# EAGLE schematic Prototype1 (EAGLE 6.1)
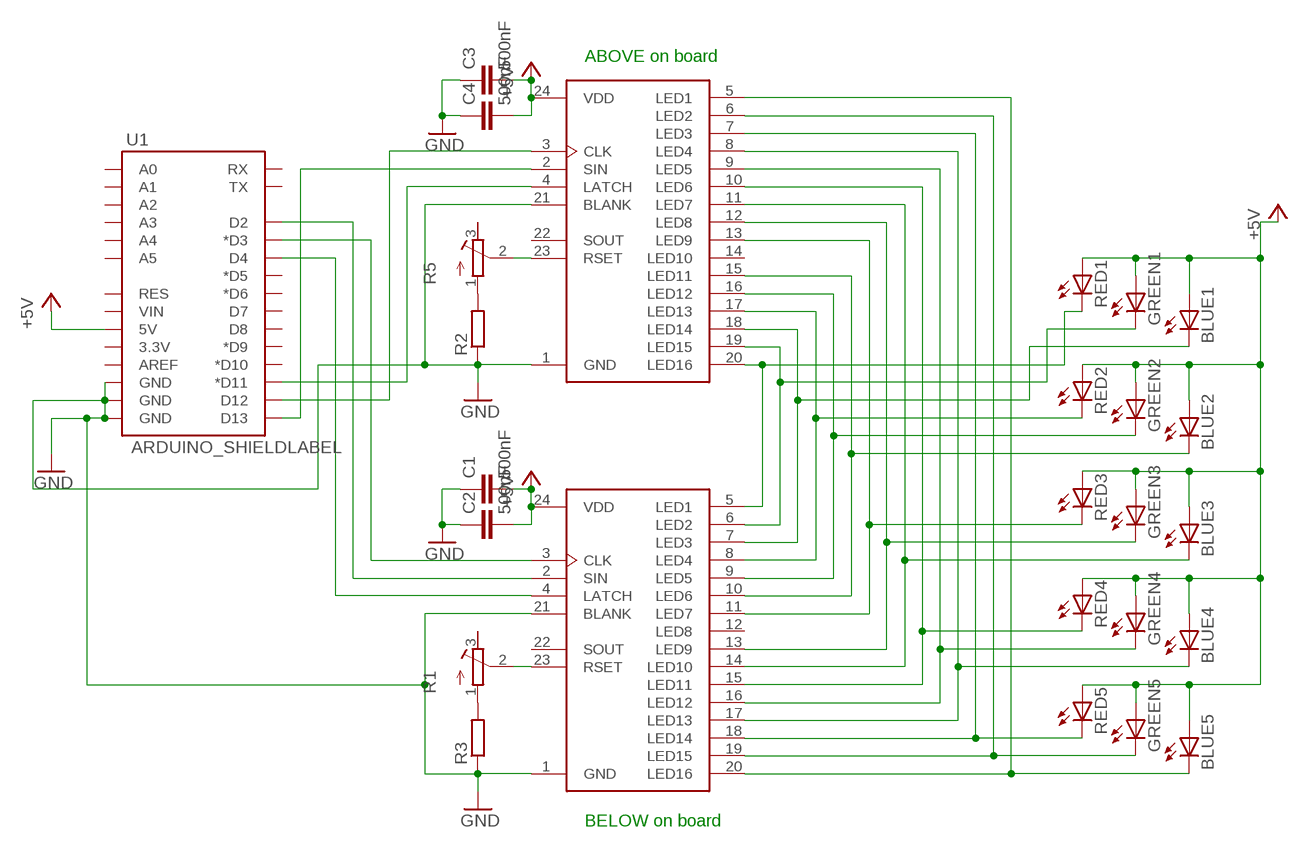
[diagram p0: schematic, sheet 1]

## Parts
BLUE1  LEDKA-3528ASYC  [KA-3528ASYC]
BLUE2  LEDKA-3528ASYC  [KA-3528ASYC]
BLUE3  LEDKA-3528ASYC  [KA-3528ASYC]
BLUE4  LEDKA-3528ASYC  [KA-3528ASYC]
BLUE5  LEDKA-3528ASYC  [KA-3528ASYC]
C1  500nF  CAPPTH  [CAP-PTH-SMALL]
C2  500nF  CAPPTH  [CAP-PTH-SMALL]
C3  500nF  CAPPTH  [CAP-PTH-SMALL]
C4  500nF  CAPPTH  [CAP-PTH-SMALL]
GREEN1  LEDKA-3528ASYC  [KA-3528ASYC]
GREEN2  LEDKA-3528ASYC  [KA-3528ASYC]
GREEN3  LEDKA-3528ASYC  [KA-3528ASYC]
GREEN4  LEDKA-3528ASYC  [KA-3528ASYC]
GREEN5  LEDKA-3528ASYC  [KA-3528ASYC]
R1  R-TRIMM3165W  [RTRIM3165W]
R2  R-EU_0204/7  [0204/7]
R3  R-EU_0204/7  [0204/7]
R5  R-TRIMM3165W  [RTRIM3165W]
RED1  LEDSML0805  [SML0805]
RED2  LEDSML0805  [SML0805]
RED3  LEDSML0805  [SML0805]
RED4  LEDSML0805  [SML0805]
RED5  LEDSML0805  [SML0805]
U1  ARDUINO_SHIELDLABEL  [DUEMILANOVE_SHIELD]
U$2  CAT4016  [SOIC24W]
U$3  CAT4016  [SOIC24W]

## Nets
+5V: BLUE1.A BLUE2.A BLUE3.A BLUE4.A BLUE5.A C1.2 C2.2 C3.2 C4.2 GREEN1.A GREEN2.A GREEN3.A GREEN4.A GREEN5.A RED1.A RED2.A RED3.A RED4.A RED5.A U1.5V U$2.24(VDD) U$3.24(VDD)
GND: C1.1 C2.1 C3.1 C4.1 R2.1 R3.1 U1.GND@0(GND) U1.GND@1(GND) U1.GND@2(GND) U$2.1(GND) U$2.21(BLANK) U$3.1(GND) U$3.21(BLANK)
N$2: R1.1(A) R3.2
N$3: R2.2 R5.1(A)
N$4: R1.2(S) U$2.23(RSET)
N$5: R5.2(S) U$3.23(RSET)
N$7: U1.D3(*D3) U$2.3(CLK)
N$8: U1.D4 U$2.4(LATCH)
N$9: U1.D13 U$3.2(SIN)
N$10: U1.D2 U$2.2(SIN)
N$11: GREEN2.C U$2.9(LED5) U$3.16(LED12)
N$12: RED2.C U$2.8(LED4) U$3.17(LED13)
N$13: BLUE1.C U$2.7(LED3) U$3.18(LED14)
N$14: GREEN1.C U$2.6(LED2) U$3.19(LED15)
N$15: BLUE2.C U$2.10(LED6) U$3.15(LED11)
N$16: RED1.C U$2.5(LED1) U$3.20(LED16)
N$17: RED3.C U$2.11(LED7) U$3.13(LED9)
N$18: GREEN3.C U$2.13(LED9) U$3.12(LED8)
N$19: BLUE3.C U$2.14(LED10) U$3.11(LED7)
N$20: RED4.C U$2.15(LED11) U$3.10(LED6)
N$21: GREEN4.C U$2.16(LED12) U$3.9(LED5)
N$22: BLUE4.C U$2.17(LED13) U$3.8(LED4)
N$23: RED5.C U$2.18(LED14) U$3.7(LED3)
N$24: GREEN5.C U$2.19(LED15) U$3.6(LED2)
N$25: U1.D12 U$3.3(CLK)
N$31: U1.D11(*D11) U$3.4(LATCH)
N$39: BLUE5.C U$2.20(LED16) U$3.5(LED1)
Unconnected: R1.3(E) R5.3(E) U1.3.3V U1.A0 U1.A1 U1.A2 U1.A3 U1.A4 U1.A5 U1.AREF U1.D5(*D5) U1.D6(*D6) U1.D7 U1.D8 U1.D9(*D9) U1.D10(*D10) U1.RES U1.RX U1.TX U1.VIN U$2.12(LED8) U$2.22(SOUT) U$3.14(LED10) U$3.22(SOUT)

## Notes on the sheet
- ABOVE on board
- BELOW on board

## Library data of the parts
BLUE1-BLUE5 GREEN1-GREEN5 RED1-RED5 = led:LED: LED OSRAM: - CHIPLED LG R971, LG N971, LY N971, LG Q971, LY Q971, LO R971, LY R971 LH N974, LH R974 LS Q976, LO Q976, LY Q976 LO Q996 - Hyper CHIPLED LW Q18S LB Q993, LB Q99A, LB R99A - SideLED LS A670, LO A670, LY A670, LG A670, LP A670 LB A673, LV A673, LT A673, LW A673 LH A674 LY A675 LS A676, LA A676, LO A676, LY A676, LW A676 LS A679, LY A679, LG A679 - Hyper Micro SIDELED® LS Y876, LA Y876, LO Y876, LY Y876 LT Y87S - SmartLED LW L88C, LW L88S LB L89C, LB L89S, LG L890 LS L89K, LO L89K, LY L89K LS L896, LA L896, LO L896, LY L896 - TOPLED LS T670, LO T670, LY T670, LG T670, LP T670 LSG T670, LSP T670, LSY T670, LOP T670, LYG T670 LG T671, LOG T671, LSG T671 LB T673, LV T673, LT T673, LW T673 LH T674 LS T676, LA T676, LO T676, LY T676, LB T676, LH T676, LSB T676, LW T676 LB T67C, LV T67C, LT T67C, LS T67K, LO T67K, LY T67K, LW E67C LS E67B, LA E67B, LO E67B, LY E67B, LB E67C, LV E67C, LT E67C LW T67C LS T679, LY T679, LG T679 LS T770, LO T770, LY T770, LG T770, LP T770 LB T773, LV T773, LT T773, LW T773 LH T774 LS E675, LA E675, LY E675, LS T675 LS T776, LA T776, LO T776, LY T776, LB T776 LHGB T686 LT T68C, LB T68C - Hyper Mini TOPLED® LB M676 - Mini TOPLED Santana® LG M470 LS M47K, LO M47K, LY M47K Source: http://www.osram.convergy.de LUXEON: - LUMILED® LXK2-PW12-R00, LXK2-PW12-S00, LXK2-PW14-U00, LXK2-PW14-V00 LXK2-PM12-R00, LXK2-PM12-S00, LXK2-PM14-U00 LXK2-PE12-Q00, LXK2-PE12-R00, LXK2-PE12-S00, LXK2-PE14-T00, LXK2-PE14-U00 LXK2-PB12-K00, LXK2-PB12-L00, LXK2-PB12-M00, LXK2-PB14-N00, LXK2-PB14-P00, LXK2-PB14-Q00 LXK2-PR12-L00, LXK2-PR12-M00, LXK2-PR14-Q00, LXK2-PR14-R00 LXK2-PD12-Q00, LXK2-PD12-R00, LXK2-PD12-S00 LXK2-PH12-R00, LXK2-PH12-S00 LXK2-PL12-P00, LXK2-PL12-Q00, LXK2-PL12-R00 Source: www.luxeon.com KINGBRIGHT: KA-3528ASYC Source: www.kingbright.com
C1-C4 = SparkFun:CAP: Capacitor Standard 0603 ceramic capacitor, and 0.1" leaded capacitor.
R1 R5 = rcl:R-TRIMM: Trimm resistor
R2 R3 = rcl:R-EU_: RESISTOR, European symbol
U1 = SparkFun:ARDUINO_SHIELD
U$2 U$3 = CAT4016:CAT4016: 16-Channel Constant Current LED Driver